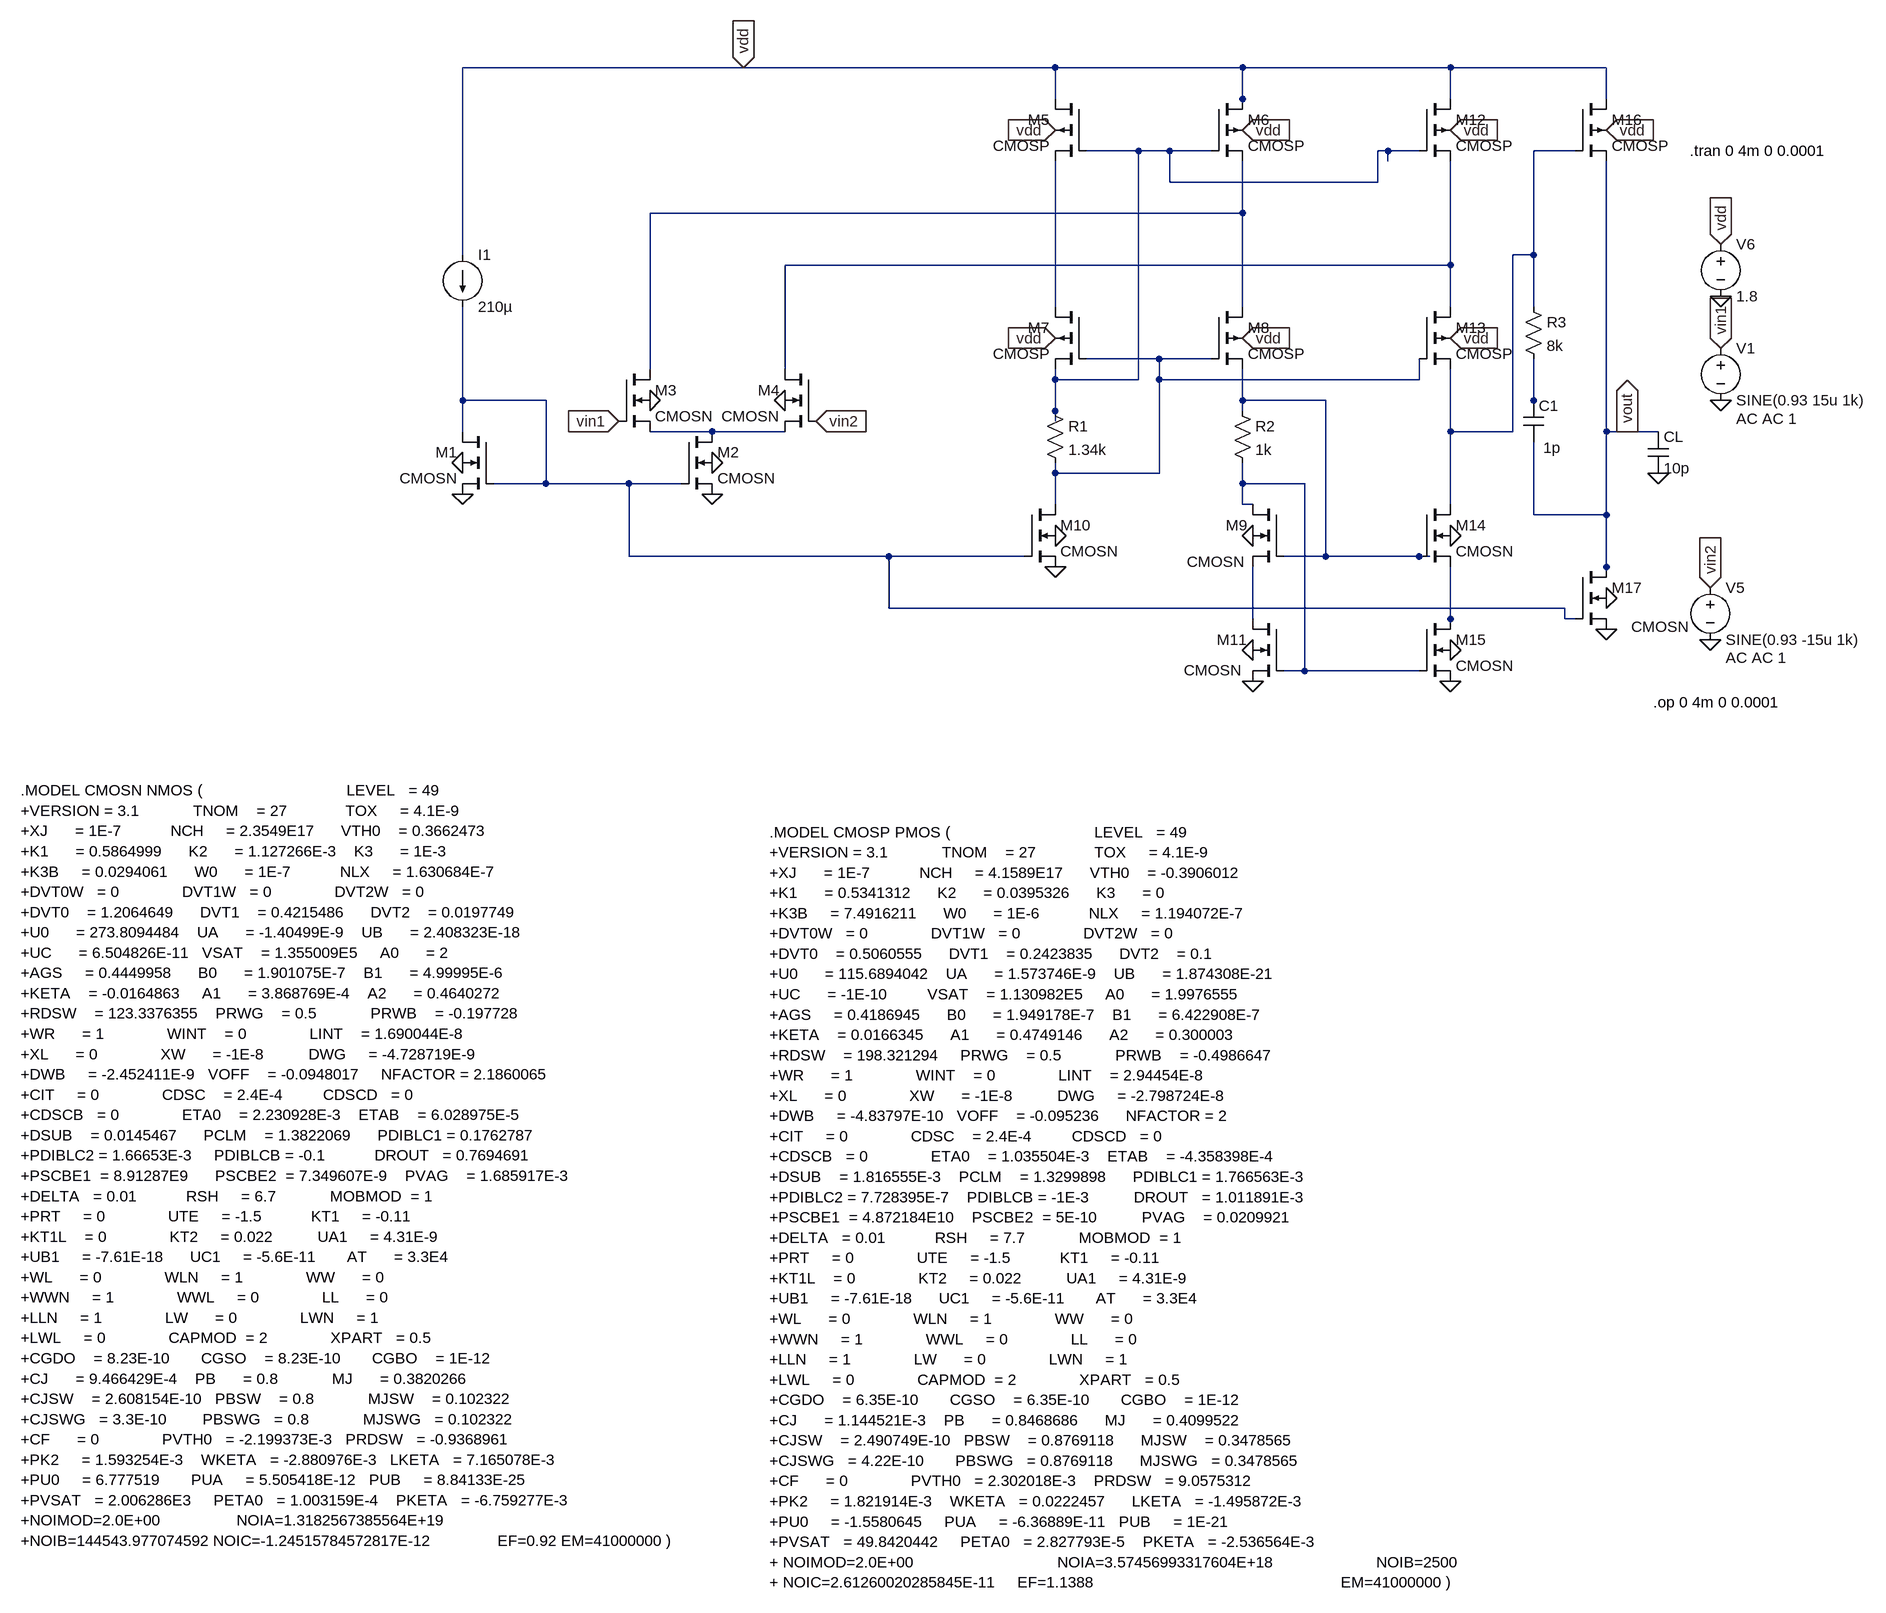
[diagram p0: schematic 2stage_fc.asc]
2stage_fc.asc, the LTspice schematic file:
Version 4
SHEET 1 3184 2052
WIRE 736 -176 304 -176
WIRE 1216 -176 736 -176
WIRE 1504 -176 1216 -176
WIRE 1824 -176 1504 -176
WIRE 2064 -176 1824 -176
WIRE 1216 -128 1216 -176
WIRE 1504 -128 1504 -176
WIRE 1824 -128 1824 -176
WIRE 2064 -128 2064 -176
WIRE 1504 -112 1504 -128
WIRE 1344 -48 1264 -48
WIRE 1392 -48 1344 -48
WIRE 1456 -48 1392 -48
WIRE 1728 -48 1712 -48
WIRE 1776 -48 1728 -48
WIRE 2016 -48 1952 -48
WIRE 1728 -32 1728 -48
WIRE 1392 0 1392 -48
WIRE 1712 0 1712 -48
WIRE 1712 0 1392 0
WIRE 1504 48 1504 -32
WIRE 1504 48 592 48
WIRE 304 112 304 -176
WIRE 1952 112 1952 -48
WIRE 1952 112 1920 112
WIRE 1824 128 1824 -32
WIRE 1824 128 800 128
WIRE 1216 192 1216 -32
WIRE 1504 192 1504 48
WIRE 1824 192 1824 128
WIRE 1952 192 1952 112
WIRE 1376 272 1264 272
WIRE 1456 272 1376 272
WIRE 592 288 592 48
WIRE 800 288 800 128
WIRE 1216 304 1216 288
WIRE 1344 304 1344 -48
WIRE 1344 304 1216 304
WIRE 1376 304 1376 272
WIRE 1776 304 1776 272
WIRE 1776 304 1376 304
WIRE 304 336 304 192
WIRE 432 336 304 336
WIRE 1504 336 1504 288
WIRE 1632 336 1504 336
WIRE 1952 336 1952 272
WIRE 1216 352 1216 304
WIRE 1504 352 1504 336
WIRE 1952 352 1952 336
WIRE 1216 368 1216 352
WIRE 304 384 304 336
WIRE 688 384 592 384
WIRE 800 384 688 384
WIRE 1824 384 1824 288
WIRE 1920 384 1920 112
WIRE 1920 384 1824 384
WIRE 2064 384 2064 -32
WIRE 2096 384 2064 384
WIRE 2144 384 2096 384
WIRE 1216 448 1216 432
WIRE 1376 448 1376 304
WIRE 1376 448 1216 448
WIRE 432 464 432 336
WIRE 432 464 352 464
WIRE 560 464 432 464
WIRE 640 464 560 464
WIRE 1504 464 1504 432
WIRE 1600 464 1504 464
WIRE 1216 496 1216 448
WIRE 1504 496 1504 464
WIRE 1520 496 1504 496
WIRE 1824 496 1824 384
WIRE 1952 512 1952 400
WIRE 2064 512 2064 384
WIRE 2064 512 1952 512
WIRE 560 576 560 464
WIRE 960 576 560 576
WIRE 1168 576 960 576
WIRE 1632 576 1632 336
WIRE 1632 576 1568 576
WIRE 1776 576 1632 576
WIRE 1792 576 1776 576
WIRE 2064 592 2064 512
WIRE 2064 608 2064 592
WIRE 960 656 960 576
WIRE 2000 656 960 656
WIRE 1520 672 1520 592
WIRE 1824 672 1824 592
WIRE 2000 672 2000 656
WIRE 2016 672 2000 672
WIRE 1824 688 1824 672
WIRE 1600 752 1600 464
WIRE 1600 752 1568 752
WIRE 1776 752 1600 752
FLAG 688 480 0
FLAG 688 432 0
FLAG 592 336 0
FLAG 800 336 0
FLAG 544 368 vin1
IOPIN 544 368 In
FLAG 848 368 vin2
IOPIN 848 368 In
FLAG 2240 256 vin1
IOPIN 2240 256 In
FLAG 2240 336 0
FLAG 2224 704 0
FLAG 2224 624 vin2
IOPIN 2224 624 In
FLAG 2240 96 vdd
IOPIN 2240 96 In
FLAG 2240 176 0
FLAG 304 480 0
FLAG 304 432 0
FLAG 1216 -80 vdd
IOPIN 1216 -80 In
FLAG 1216 240 vdd
IOPIN 1216 240 In
FLAG 1216 592 0
FLAG 1216 544 0
FLAG 1520 544 0
FLAG 1520 768 0
FLAG 1520 720 0
FLAG 1504 240 vdd
IOPIN 1504 240 In
FLAG 1504 -80 vdd
IOPIN 1504 -80 In
FLAG 1824 768 0
FLAG 1824 720 0
FLAG 2064 640 0
FLAG 2064 688 0
FLAG 1824 544 0
FLAG 1824 240 vdd
IOPIN 1824 240 In
FLAG 1824 -80 vdd
IOPIN 1824 -80 In
FLAG 2064 -80 vdd
IOPIN 2064 -80 In
FLAG 2144 448 0
FLAG 736 -176 vdd
IOPIN 736 -176 In
FLAG 2096 384 vout
IOPIN 2096 384 Out
SYMBOL nmos4 544 288 R0
SYMATTR InstName M3
SYMATTR Value CMOSN
SYMATTR Value2 l=0.5u w=50u
SYMBOL nmos4 848 288 M0
SYMATTR InstName M4
SYMATTR Value CMOSN
SYMATTR Value2 l=0.5u w=50u
SYMBOL nmos4 640 384 R0
SYMATTR InstName M2
SYMATTR Value CMOSN
SYMATTR Value2 l=0.5u w=7u
SYMBOL voltage 2240 240 R0
WINDOW 123 24 124 Left 2
WINDOW 39 0 0 Left 0
SYMATTR Value2 AC AC 1
SYMATTR InstName V1
SYMATTR Value SINE(0.93 15u 1k)
SYMBOL voltage 2224 608 R0
WINDOW 123 24 124 Left 2
WINDOW 39 0 0 Left 0
SYMATTR Value2 AC AC 1
SYMATTR InstName V5
SYMATTR Value SINE(0.93 -15u 1k)
SYMBOL voltage 2240 80 R0
WINDOW 123 0 0 Left 0
WINDOW 39 0 0 Left 0
SYMATTR InstName V6
SYMATTR Value 1.8
SYMBOL nmos4 352 384 M0
SYMATTR InstName M1
SYMATTR Value CMOSN
SYMATTR Value2 l=0.5u w=7u
SYMBOL current 304 112 R0
WINDOW 123 0 0 Left 0
WINDOW 39 0 0 Left 0
SYMATTR InstName I1
SYMATTR Value 210µ
SYMBOL pmos4 1264 -128 M0
SYMATTR InstName M5
SYMATTR Value CMOSP
SYMATTR Value2 l=0.3u w=170u
SYMBOL pmos4 1264 192 M0
SYMATTR InstName M7
SYMATTR Value CMOSP
SYMATTR Value2 l=0.3u w=170u
SYMBOL nmos4 1168 496 R0
SYMATTR InstName M10
SYMATTR Value CMOSN
SYMATTR Value2 l=0.5u w=9u
SYMBOL res 1200 336 R0
SYMATTR InstName R1
SYMATTR Value 1.34k
SYMBOL pmos4 1456 -128 R0
SYMATTR InstName M6
SYMATTR Value CMOSP
SYMATTR Value2 l=0.3u w=170u
SYMBOL pmos4 1456 192 R0
SYMATTR InstName M8
SYMATTR Value CMOSP
SYMATTR Value2 l=0.3u w=170u
SYMBOL res 1488 336 R0
SYMATTR InstName R2
SYMATTR Value 1k
SYMBOL nmos4 1568 496 M0
WINDOW 3 60 88 Left 2
SYMATTR Value CMOSN
SYMATTR InstName M9
SYMATTR Value2 l=0.5u w=70u
SYMBOL nmos4 1568 672 M0
WINDOW 3 65 79 Left 2
SYMATTR Value CMOSN
SYMATTR InstName M11
SYMATTR Value2 l=0.5u w=70u
SYMBOL pmos4 1776 -128 R0
SYMATTR InstName M12
SYMATTR Value CMOSP
SYMATTR Value2 l=0.3u w=170u
SYMBOL pmos4 1776 192 R0
SYMATTR InstName M13
SYMATTR Value CMOSP
SYMATTR Value2 l=0.3u w=170u
SYMBOL nmos4 1776 496 R0
SYMATTR InstName M14
SYMATTR Value CMOSN
SYMATTR Value2 l=0.5u w=70u
SYMBOL nmos4 1776 672 R0
SYMATTR InstName M15
SYMATTR Value CMOSN
SYMATTR Value2 l=0.5u w=70u
SYMBOL pmos4 2016 -128 R0
SYMATTR InstName M16
SYMATTR Value CMOSP
SYMATTR Value2 l=0.5u w=30u
SYMBOL nmos4 2016 592 R0
WINDOW 3 86 92 Left 2
SYMATTR Value CMOSN
SYMATTR InstName M17
SYMATTR Value2 l=0.5u w=30u
SYMBOL cap 1936 336 R0
WINDOW 3 31 73 Left 2
SYMATTR Value 1p
SYMATTR InstName C1
SYMBOL cap 2128 384 R0
SYMATTR InstName CL
SYMATTR Value 10p
SYMBOL res 1936 176 R0
SYMATTR InstName R3
SYMATTR Value 8k
TEXT -376 936 Left 2 !.MODEL CMOSN NMOS (                                LEVEL   = 49\n+VERSION = 3.1            TNOM    = 27             TOX     = 4.1E-9\n+XJ      = 1E-7           NCH     = 2.3549E17      VTH0    = 0.3662473\n+K1      = 0.5864999      K2      = 1.127266E-3    K3      = 1E-3\n+K3B     = 0.0294061      W0      = 1E-7           NLX     = 1.630684E-7\n+DVT0W   = 0              DVT1W   = 0              DVT2W   = 0\n+DVT0    = 1.2064649      DVT1    = 0.4215486      DVT2    = 0.0197749\n+U0      = 273.8094484    UA      = -1.40499E-9    UB      = 2.408323E-18\n+UC      = 6.504826E-11   VSAT    = 1.355009E5     A0      = 2\n+AGS     = 0.4449958      B0      = 1.901075E-7    B1      = 4.99995E-6\n+KETA    = -0.0164863     A1      = 3.868769E-4    A2      = 0.4640272\n+RDSW    = 123.3376355    PRWG    = 0.5            PRWB    = -0.197728\n+WR      = 1              WINT    = 0              LINT    = 1.690044E-8\n+XL      = 0              XW      = -1E-8          DWG     = -4.728719E-9\n+DWB     = -2.452411E-9   VOFF    = -0.0948017     NFACTOR = 2.1860065\n+CIT     = 0              CDSC    = 2.4E-4         CDSCD   = 0\n+CDSCB   = 0              ETA0    = 2.230928E-3    ETAB    = 6.028975E-5\n+DSUB    = 0.0145467      PCLM    = 1.3822069      PDIBLC1 = 0.1762787\n+PDIBLC2 = 1.66653E-3     PDIBLCB = -0.1           DROUT   = 0.7694691\n+PSCBE1  = 8.91287E9      PSCBE2  = 7.349607E-9    PVAG    = 1.685917E-3\n+DELTA   = 0.01           RSH     = 6.7            MOBMOD  = 1\n+PRT     = 0              UTE     = -1.5           KT1     = -0.11\n+KT1L    = 0              KT2     = 0.022          UA1     = 4.31E-9\n+UB1     = -7.61E-18      UC1     = -5.6E-11       AT      = 3.3E4\n+WL      = 0              WLN     = 1              WW      = 0\n+WWN     = 1              WWL     = 0              LL      = 0\n+LLN     = 1              LW      = 0              LWN     = 1\n+LWL     = 0              CAPMOD  = 2              XPART   = 0.5\n+CGDO    = 8.23E-10       CGSO    = 8.23E-10       CGBO    = 1E-12\n+CJ      = 9.466429E-4    PB      = 0.8            MJ      = 0.3820266\n+CJSW    = 2.608154E-10   PBSW    = 0.8            MJSW    = 0.102322\n+CJSWG   = 3.3E-10        PBSWG   = 0.8            MJSWG   = 0.102322\n+CF      = 0              PVTH0   = -2.199373E-3   PRDSW   = -0.9368961\n+PK2     = 1.593254E-3    WKETA   = -2.880976E-3   LKETA   = 7.165078E-3\n+PU0     = 6.777519       PUA     = 5.505418E-12   PUB     = 8.84133E-25\n+PVSAT   = 2.006286E3     PETA0   = 1.003159E-4    PKETA   = -6.759277E-3\n+NOIMOD=2.0E+00                 NOIA=1.3182567385564E+19\n+NOIB=144543.977074592 NOIC=-1.24515784572817E-12               EF=0.92 EM=41000000 )
TEXT 776 1000 Left 2 !.MODEL CMOSP PMOS (                                LEVEL   = 49\n+VERSION = 3.1            TNOM    = 27             TOX     = 4.1E-9\n+XJ      = 1E-7           NCH     = 4.1589E17      VTH0    = -0.3906012\n+K1      = 0.5341312      K2      = 0.0395326      K3      = 0\n+K3B     = 7.4916211      W0      = 1E-6           NLX     = 1.194072E-7\n+DVT0W   = 0              DVT1W   = 0              DVT2W   = 0\n+DVT0    = 0.5060555      DVT1    = 0.2423835      DVT2    = 0.1\n+U0      = 115.6894042    UA      = 1.573746E-9    UB      = 1.874308E-21\n+UC      = -1E-10         VSAT    = 1.130982E5     A0      = 1.9976555\n+AGS     = 0.4186945      B0      = 1.949178E-7    B1      = 6.422908E-7\n+KETA    = 0.0166345      A1      = 0.4749146      A2      = 0.300003\n+RDSW    = 198.321294     PRWG    = 0.5            PRWB    = -0.4986647\n+WR      = 1              WINT    = 0              LINT    = 2.94454E-8\n+XL      = 0              XW      = -1E-8          DWG     = -2.798724E-8\n+DWB     = -4.83797E-10   VOFF    = -0.095236      NFACTOR = 2\n+CIT     = 0              CDSC    = 2.4E-4         CDSCD   = 0\n+CDSCB   = 0              ETA0    = 1.035504E-3    ETAB    = -4.358398E-4\n+DSUB    = 1.816555E-3    PCLM    = 1.3299898      PDIBLC1 = 1.766563E-3\n+PDIBLC2 = 7.728395E-7    PDIBLCB = -1E-3          DROUT   = 1.011891E-3\n+PSCBE1  = 4.872184E10    PSCBE2  = 5E-10          PVAG    = 0.0209921\n+DELTA   = 0.01           RSH     = 7.7            MOBMOD  = 1\n+PRT     = 0              UTE     = -1.5           KT1     = -0.11\n+KT1L    = 0              KT2     = 0.022          UA1     = 4.31E-9\n+UB1     = -7.61E-18      UC1     = -5.6E-11       AT      = 3.3E4\n+WL      = 0              WLN     = 1              WW      = 0\n+WWN     = 1              WWL     = 0              LL      = 0\n+LLN     = 1              LW      = 0              LWN     = 1\n+LWL     = 0              CAPMOD  = 2              XPART   = 0.5\n+CGDO    = 6.35E-10       CGSO    = 6.35E-10       CGBO    = 1E-12\n+CJ      = 1.144521E-3    PB      = 0.8468686      MJ      = 0.4099522\n+CJSW    = 2.490749E-10   PBSW    = 0.8769118      MJSW    = 0.3478565\n+CJSWG   = 4.22E-10       PBSWG   = 0.8769118      MJSWG   = 0.3478565\n+CF      = 0              PVTH0   = 2.302018E-3    PRDSW   = 9.0575312\n+PK2     = 1.821914E-3    WKETA   = 0.0222457      LKETA   = -1.495872E-3\n+PU0     = -1.5580645     PUA     = -6.36889E-11   PUB     = 1E-21\n+PVSAT   = 49.8420442     PETA0   = 2.827793E-5    PKETA   = -2.536564E-3 \n+ NOIMOD=2.0E+00                                NOIA=3.57456993317604E+18                       NOIB=2500\n+ NOIC=2.61260020285845E-11     EF=1.1388                                                       EM=41000000 )
TEXT 2192 -48 Left 2 !.tran 0 4m 0 0.0001
TEXT 2136 800 Left 2 !.op 0 4m 0 0.0001

The netlist it stands for:
* 2stage_fc.asc
M3 N003 vin1 N010 0 CMOSN l=0.5u w=50u
M4 N004 vin2 N010 0 CMOSN l=0.5u w=50u
M2 N010 N007 0 0 CMOSN l=0.5u w=7u
V1 vin1 0 SINE(0.93 15u 1k) AC AC 1
V5 vin2 0 SINE(0.93 -15u 1k) AC AC 1
V6 vdd 0 1.8
M1 N007 N007 0 0 CMOSN l=0.5u w=7u
I1 vdd N007 210µ
M5 vdd N001 N005 vdd CMOSP l=0.3u w=170u
M7 N005 N006 N001 vdd CMOSP l=0.3u w=170u
M10 N006 N007 0 0 CMOSN l=0.5u w=9u
R1 N001 N006 1.34k
M6 vdd N001 N003 vdd CMOSP l=0.3u w=170u
M8 N003 N006 N008 vdd CMOSP l=0.3u w=170u
R2 N008 N011 1k
M9 N011 N008 N012 0 CMOSN l=0.5u w=70u
M11 N012 N011 0 0 CMOSN l=0.5u w=70u
M12 vdd N001 N004 vdd CMOSP l=0.3u w=170u
M13 N004 N006 N002 vdd CMOSP l=0.3u w=170u
M14 N002 N008 N013 0 CMOSN l=0.5u w=70u
M15 N013 N011 0 0 CMOSN l=0.5u w=70u
M16 vdd N002 vout vdd CMOSP l=0.5u w=30u
M17 vout N007 0 0 CMOSN l=0.5u w=30u
C1 N009 vout 1p
CL vout 0 10p
R3 N002 N009 8k
.model NMOS NMOS
.model PMOS PMOS
.lib standard.mos
.MODEL CMOSN NMOS (                                LEVEL   = 49
+VERSION = 3.1            TNOM    = 27             TOX     = 4.1E-9
+XJ      = 1E-7           NCH     = 2.3549E17      VTH0    = 0.3662473
+K1      = 0.5864999      K2      = 1.127266E-3    K3      = 1E-3
+K3B     = 0.0294061      W0      = 1E-7           NLX     = 1.630684E-7
+DVT0W   = 0              DVT1W   = 0              DVT2W   = 0
+DVT0    = 1.2064649      DVT1    = 0.4215486      DVT2    = 0.0197749
+U0      = 273.8094484    UA      = -1.40499E-9    UB      = 2.408323E-18
+UC      = 6.504826E-11   VSAT    = 1.355009E5     A0      = 2
+AGS     = 0.4449958      B0      = 1.901075E-7    B1      = 4.99995E-6
+KETA    = -0.0164863     A1      = 3.868769E-4    A2      = 0.4640272
+RDSW    = 123.3376355    PRWG    = 0.5            PRWB    = -0.197728
+WR      = 1              WINT    = 0              LINT    = 1.690044E-8
+XL      = 0              XW      = -1E-8          DWG     = -4.728719E-9
+DWB     = -2.452411E-9   VOFF    = -0.0948017     NFACTOR = 2.1860065
+CIT     = 0              CDSC    = 2.4E-4         CDSCD   = 0
+CDSCB   = 0              ETA0    = 2.230928E-3    ETAB    = 6.028975E-5
+DSUB    = 0.0145467      PCLM    = 1.3822069      PDIBLC1 = 0.1762787
+PDIBLC2 = 1.66653E-3     PDIBLCB = -0.1           DROUT   = 0.7694691
+PSCBE1  = 8.91287E9      PSCBE2  = 7.349607E-9    PVAG    = 1.685917E-3
+DELTA   = 0.01           RSH     = 6.7            MOBMOD  = 1
+PRT     = 0              UTE     = -1.5           KT1     = -0.11
+KT1L    = 0              KT2     = 0.022          UA1     = 4.31E-9
+UB1     = -7.61E-18      UC1     = -5.6E-11       AT      = 3.3E4
+WL      = 0              WLN     = 1              WW      = 0
+WWN     = 1              WWL     = 0              LL      = 0
+LLN     = 1              LW      = 0              LWN     = 1
+LWL     = 0              CAPMOD  = 2              XPART   = 0.5
+CGDO    = 8.23E-10       CGSO    = 8.23E-10       CGBO    = 1E-12
+CJ      = 9.466429E-4    PB      = 0.8            MJ      = 0.3820266
+CJSW    = 2.608154E-10   PBSW    = 0.8            MJSW    = 0.102322
+CJSWG   = 3.3E-10        PBSWG   = 0.8            MJSWG   = 0.102322
+CF      = 0              PVTH0   = -2.199373E-3   PRDSW   = -0.9368961
+PK2     = 1.593254E-3    WKETA   = -2.880976E-3   LKETA   = 7.165078E-3
+PU0     = 6.777519       PUA     = 5.505418E-12   PUB     = 8.84133E-25
+PVSAT   = 2.006286E3     PETA0   = 1.003159E-4    PKETA   = -6.759277E-3
+NOIMOD=2.0E+00                 NOIA=1.3182567385564E+19
+NOIB=144543.977074592 NOIC=-1.24515784572817E-12               EF=0.92 EM=41000000 )
.MODEL CMOSP PMOS (                                LEVEL   = 49
+VERSION = 3.1            TNOM    = 27             TOX     = 4.1E-9
+XJ      = 1E-7           NCH     = 4.1589E17      VTH0    = -0.3906012
+K1      = 0.5341312      K2      = 0.0395326      K3      = 0
+K3B     = 7.4916211      W0      = 1E-6           NLX     = 1.194072E-7
+DVT0W   = 0              DVT1W   = 0              DVT2W   = 0
+DVT0    = 0.5060555      DVT1    = 0.2423835      DVT2    = 0.1
+U0      = 115.6894042    UA      = 1.573746E-9    UB      = 1.874308E-21
+UC      = -1E-10         VSAT    = 1.130982E5     A0      = 1.9976555
+AGS     = 0.4186945      B0      = 1.949178E-7    B1      = 6.422908E-7
+KETA    = 0.0166345      A1      = 0.4749146      A2      = 0.300003
+RDSW    = 198.321294     PRWG    = 0.5            PRWB    = -0.4986647
+WR      = 1              WINT    = 0              LINT    = 2.94454E-8
+XL      = 0              XW      = -1E-8          DWG     = -2.798724E-8
+DWB     = -4.83797E-10   VOFF    = -0.095236      NFACTOR = 2
+CIT     = 0              CDSC    = 2.4E-4         CDSCD   = 0
+CDSCB   = 0              ETA0    = 1.035504E-3    ETAB    = -4.358398E-4
+DSUB    = 1.816555E-3    PCLM    = 1.3299898      PDIBLC1 = 1.766563E-3
+PDIBLC2 = 7.728395E-7    PDIBLCB = -1E-3          DROUT   = 1.011891E-3
+PSCBE1  = 4.872184E10    PSCBE2  = 5E-10          PVAG    = 0.0209921
+DELTA   = 0.01           RSH     = 7.7            MOBMOD  = 1
+PRT     = 0              UTE     = -1.5           KT1     = -0.11
+KT1L    = 0              KT2     = 0.022          UA1     = 4.31E-9
+UB1     = -7.61E-18      UC1     = -5.6E-11       AT      = 3.3E4
+WL      = 0              WLN     = 1              WW      = 0
+WWN     = 1              WWL     = 0              LL      = 0
+LLN     = 1              LW      = 0              LWN     = 1
+LWL     = 0              CAPMOD  = 2              XPART   = 0.5
+CGDO    = 6.35E-10       CGSO    = 6.35E-10       CGBO    = 1E-12
+CJ      = 1.144521E-3    PB      = 0.8468686      MJ      = 0.4099522
+CJSW    = 2.490749E-10   PBSW    = 0.8769118      MJSW    = 0.3478565
+CJSWG   = 4.22E-10       PBSWG   = 0.8769118      MJSWG   = 0.3478565
+CF      = 0              PVTH0   = 2.302018E-3    PRDSW   = 9.0575312
+PK2     = 1.821914E-3    WKETA   = 0.0222457      LKETA   = -1.495872E-3
+PU0     = -1.5580645     PUA     = -6.36889E-11   PUB     = 1E-21
+PVSAT   = 49.8420442     PETA0   = 2.827793E-5    PKETA   = -2.536564E-3
+ NOIMOD=2.0E+00                                NOIA=3.57456993317604E+18                       NOIB=2500
+ NOIC=2.61260020285845E-11     EF=1.1388                                                       EM=41000000 )
.tran 0 4m 0 0.0001
.op 0 4m 0 0.0001
.backanno
.end